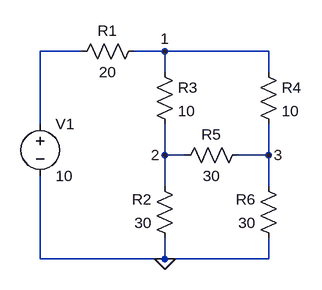
[diagram p0: schematic q1_circuit_5.asc]
q1_circuit_5.asc, the LTspice schematic file:
Version 4
SHEET 1 880 680
WIRE 144 -64 80 -64
WIRE 272 -64 224 -64
WIRE 432 -64 272 -64
WIRE 272 -32 272 -64
WIRE 432 -32 432 -64
WIRE 80 48 80 -64
WIRE 272 96 272 48
WIRE 304 96 272 96
WIRE 432 96 432 48
WIRE 432 96 384 96
WIRE 272 144 272 96
WIRE 432 144 432 96
WIRE 80 256 80 128
WIRE 272 256 272 224
WIRE 272 256 80 256
WIRE 432 256 432 224
WIRE 432 256 272 256
FLAG 272 256 0
FLAG 272 -64 1
FLAG 272 96 2
FLAG 432 96 3
SYMBOL voltage 80 32 R0
SYMATTR InstName V1
SYMATTR Value 10
SYMBOL res 240 -80 R90
WINDOW 0 0 56 VBottom 2
WINDOW 3 32 56 VTop 2
SYMATTR InstName R1
SYMATTR Value 20
SYMBOL res 288 240 R180
WINDOW 0 36 76 Left 2
WINDOW 3 36 40 Left 2
SYMATTR InstName R2
SYMATTR Value 30
SYMBOL res 256 -48 R0
SYMATTR InstName R3
SYMATTR Value 10
SYMBOL res 416 -48 R0
SYMATTR InstName R4
SYMATTR Value 10
SYMBOL res 400 80 R90
WINDOW 0 0 56 VBottom 2
WINDOW 3 32 56 VTop 2
SYMATTR InstName R5
SYMATTR Value 30
SYMBOL res 448 240 R180
WINDOW 0 36 76 Left 2
WINDOW 3 36 40 Left 2
SYMATTR InstName R6
SYMATTR Value 30

The netlist it stands for:
* q1_circuit_5.asc
V1 N001 0 10
R1 1 N001 20
R2 0 2 30
R3 1 2 10
R4 1 3 10
R5 3 2 30
R6 0 3 30
.backanno
.end